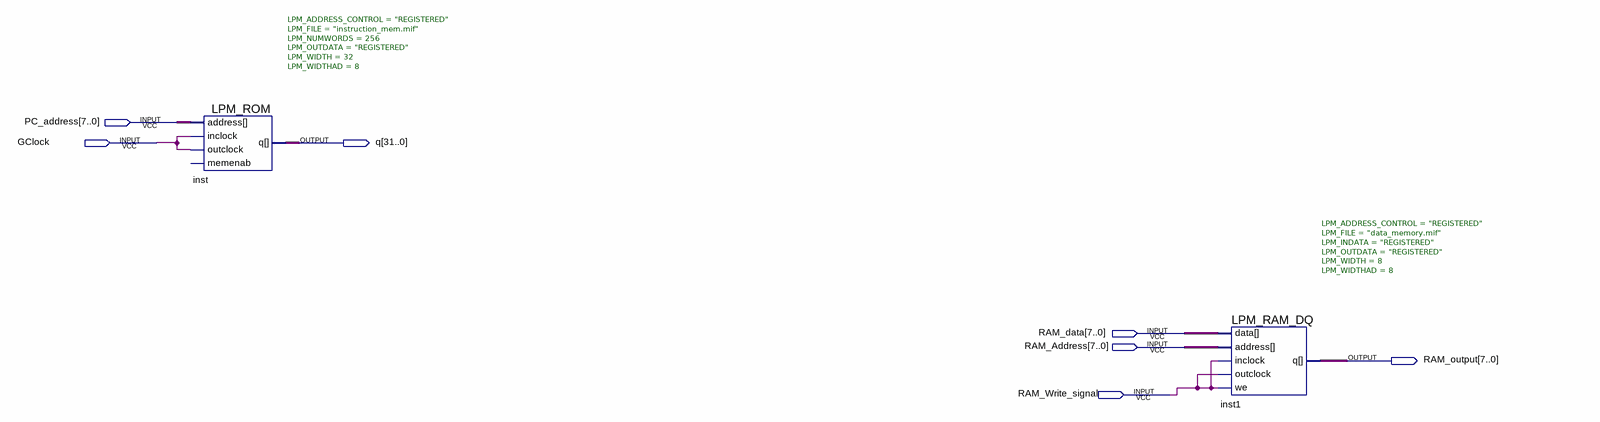
[diagram p0: schematic sheet]
// Quartus schematic Lab2.bdf as structural Verilog: 2 symbols, 7 pins
module Lab2 (
  input  [7:0] PC_address,
  input  GClock,
  input  [7:0] RAM_data,
  input  [7:0] RAM_Address,
  input  RAM_Write_signal,
  output [31:0] q,
  output [7:0] RAM_output
);

  LPM_ROM #(.LPM_ADDRESS_CONTROL("REGISTERED"), .LPM_FILE("instruction_mem.mif"), .LPM_NUMWORDS(256), .LPM_OUTDATA("REGISTERED"), .LPM_WIDTH(32), .LPM_WIDTHAD(8)) inst (
    .address(PC_address), .inclock(GClock), .outclock(GClock), .q(q));  // open: memenab
  LPM_RAM_DQ #(.LPM_ADDRESS_CONTROL("REGISTERED"), .LPM_FILE("data_memory.mif"), .LPM_INDATA("REGISTERED"), .LPM_OUTDATA("REGISTERED"), .LPM_WIDTH(8), .LPM_WIDTHAD(8)) inst1 (
    .inclock(RAM_Write_signal), .data(RAM_data), .address(RAM_Address), .we(RAM_Write_signal),
    .outclock(RAM_Write_signal), .q(RAM_output));
endmodule
